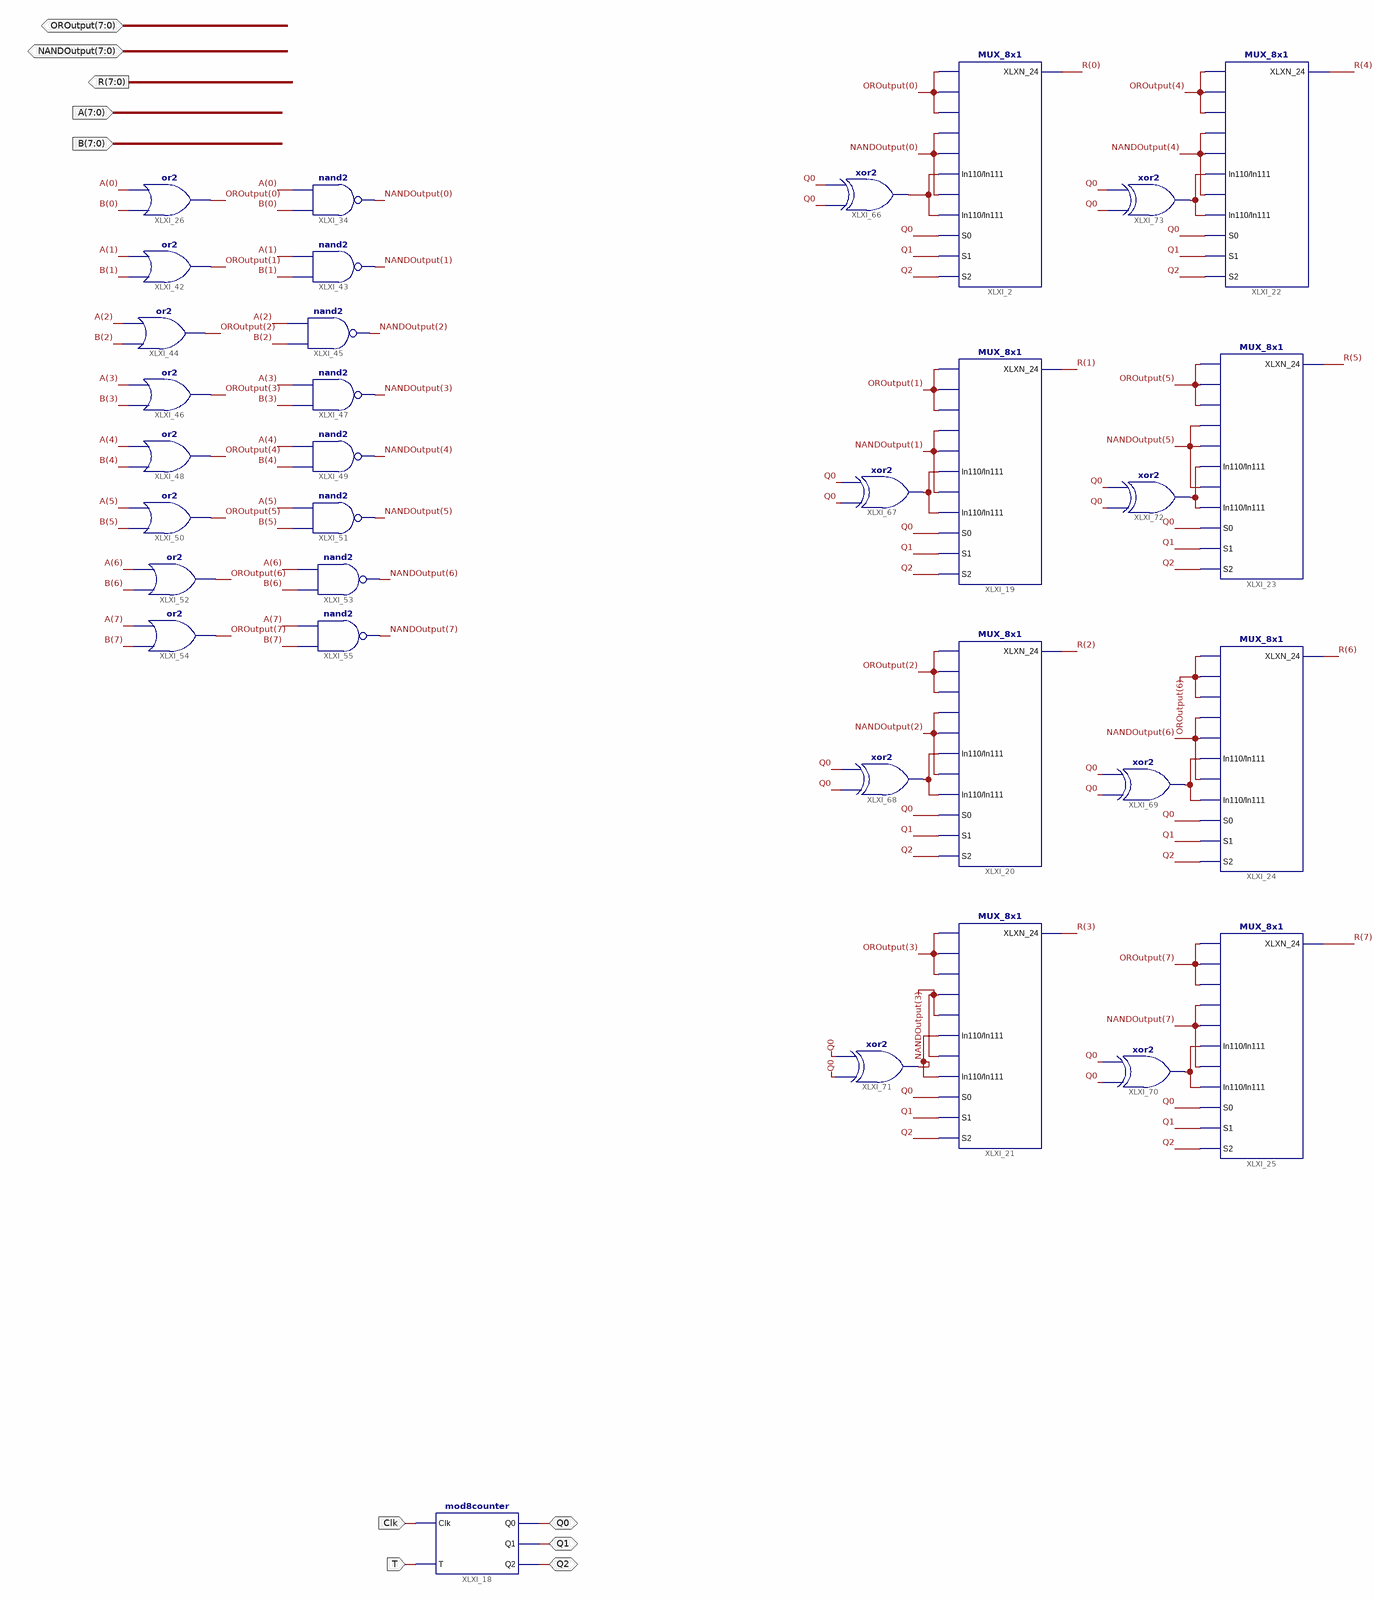
[diagram p0: schematic sheet 1]
// Xilinx ISE schematic first_f.sch (spartan3) as structural Verilog: 33 symbols, 10 ports
module first_f (
  input  Clk,
  input  T,
  input  [7:0] A,
  input  [7:0] B,
  inout  Q0,
  inout  Q1,
  inout  Q2,
  inout  [7:0] NANDOutput,
  inout  [7:0] OROutput,
  output [7:0] R
);

  wire XLXN_49, XLXN_53, XLXN_57, XLXN_61, XLXN_66, XLXN_71, XLXN_72, XLXN_79;

  MUX_8x1 XLXI_2 (
    .In000(OROutput[0]), .In010(OROutput[0]), .In001(OROutput[0]), .In011(NANDOutput[0]),
    .In100(NANDOutput[0]), .In110(XLXN_49), .In101(NANDOutput[0]), .In111(XLXN_49), .S0(Q0), .S1(Q1),
    .S2(Q2), .XLXN_24(R[0]));
  mod8counter XLXI_18 (.Clk(Clk), .T(T), .Q0(Q0), .Q1(Q1), .Q2(Q2));
  MUX_8x1 XLXI_19 (
    .In000(OROutput[1]), .In010(OROutput[1]), .In001(OROutput[1]), .In011(NANDOutput[1]),
    .In100(NANDOutput[1]), .In110(XLXN_53), .In101(NANDOutput[1]), .In111(XLXN_53), .S0(Q0), .S1(Q1),
    .S2(Q2), .XLXN_24(R[1]));
  MUX_8x1 XLXI_20 (
    .In000(OROutput[2]), .In010(OROutput[2]), .In001(OROutput[2]), .In011(NANDOutput[2]),
    .In100(NANDOutput[2]), .In110(XLXN_57), .In101(NANDOutput[2]), .In111(XLXN_57), .S0(Q0), .S1(Q1),
    .S2(Q2), .XLXN_24(R[2]));
  MUX_8x1 XLXI_21 (
    .In000(OROutput[3]), .In010(OROutput[3]), .In001(OROutput[3]), .In011(NANDOutput[3]),
    .In100(NANDOutput[3]), .In110(XLXN_61), .In101(NANDOutput[3]), .In111(XLXN_61), .S0(Q0), .S1(Q1),
    .S2(Q2), .XLXN_24(R[3]));
  MUX_8x1 XLXI_22 (
    .In000(OROutput[4]), .In010(OROutput[4]), .In001(OROutput[4]), .In011(NANDOutput[4]),
    .In100(NANDOutput[4]), .In110(XLXN_79), .In101(NANDOutput[4]), .In111(XLXN_79), .S0(Q0), .S1(Q1),
    .S2(Q2), .XLXN_24(R[4]));
  MUX_8x1 XLXI_23 (
    .In000(OROutput[5]), .In010(OROutput[5]), .In001(OROutput[5]), .In011(NANDOutput[5]),
    .In100(NANDOutput[5]), .In110(XLXN_72), .In101(NANDOutput[5]), .In111(XLXN_72), .S0(Q0), .S1(Q1),
    .S2(Q2), .XLXN_24(R[5]));
  MUX_8x1 XLXI_24 (
    .In000(OROutput[6]), .In010(OROutput[6]), .In001(OROutput[6]), .In011(NANDOutput[6]),
    .In100(NANDOutput[6]), .In110(XLXN_71), .In101(NANDOutput[6]), .In111(XLXN_71), .S0(Q0), .S1(Q1),
    .S2(Q2), .XLXN_24(R[6]));
  MUX_8x1 XLXI_25 (
    .In000(OROutput[7]), .In010(OROutput[7]), .In001(OROutput[7]), .In011(NANDOutput[7]),
    .In100(NANDOutput[7]), .In110(XLXN_66), .In101(NANDOutput[7]), .In111(XLXN_66), .S0(Q0), .S1(Q1),
    .S2(Q2), .XLXN_24(R[7]));
  or XLXI_26 (OROutput[0], B[0], A[0]);
  nand XLXI_34 (NANDOutput[0], B[0], A[0]);
  or XLXI_42 (OROutput[1], B[1], A[1]);
  nand XLXI_43 (NANDOutput[1], B[1], A[1]);
  or XLXI_44 (OROutput[2], B[2], A[2]);
  nand XLXI_45 (NANDOutput[2], B[2], A[2]);
  or XLXI_46 (OROutput[3], B[3], A[3]);
  nand XLXI_47 (NANDOutput[3], B[3], A[3]);
  or XLXI_48 (OROutput[4], B[4], A[4]);
  nand XLXI_49 (NANDOutput[4], B[4], A[4]);
  or XLXI_50 (OROutput[5], B[5], A[5]);
  nand XLXI_51 (NANDOutput[5], B[5], A[5]);
  or XLXI_52 (OROutput[6], B[6], A[6]);
  nand XLXI_53 (NANDOutput[6], B[6], A[6]);
  or XLXI_54 (OROutput[7], B[7], A[7]);
  nand XLXI_55 (NANDOutput[7], B[7], A[7]);
  xor XLXI_66 (XLXN_49, Q0, Q0);
  xor XLXI_67 (XLXN_53, Q0, Q0);
  xor XLXI_68 (XLXN_57, Q0, Q0);
  xor XLXI_69 (XLXN_71, Q0, Q0);
  xor XLXI_70 (XLXN_66, Q0, Q0);
  xor XLXI_71 (XLXN_61, Q0, Q0);
  xor XLXI_72 (XLXN_72, Q0, Q0);
  xor XLXI_73 (XLXN_79, Q0, Q0);
endmodule
